# Altium schematic sheet rocket.SchDoc: Наименование
size 420 x 297 mm; ApprovedBy: Утвердил; CheckedBy: Проверил; Author: Разработал; CompanyName: ВлГУ; DrawnBy: Н.Контр; Engineer: Т.Контр; SheetNumber: 1; SheetTotal: 4; PageSetup: Record=PageOptions|CenterHorizontal=True|CenterVertical=True|PrintScale=0.94|XCorrection=1.00|YCorrection=1.00|PrintKind=1|BorderSize=5000000|LeftOffset=0|BottomOffset=0|Orientation=1|PaperLength=1000|PaperWidth=1000|Scale=100|PaperSource=7|PrintQuality=-4|MediaType=1|DitherType=10|PaperKind=A4|PrintScaleMode=1; HeadOfSector: Нач. сектора; MainDevice: Перв.примен.; Name: Наименование; DocumentName: Sheet1.SCHDOC
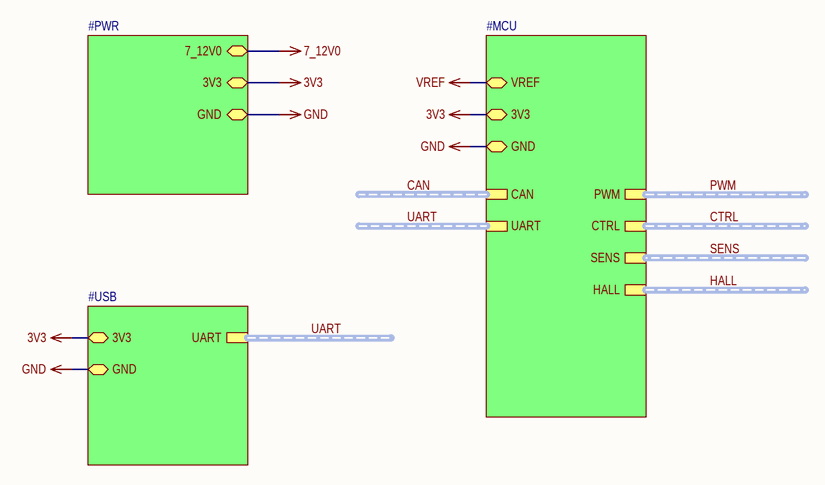
[diagram p0: rocket.SchDoc]

## Sub-sheets
#MCU = mcu.SchDoc: GND (bidir), 3V3 (bidir), CAN (harness CAN), UART (harness UART), CTRL (harness CTRL), VREF (bidir), SENS (harness SENS), HALL (harness HALL), PWM (harness PWM)
#PWR = power.SchDoc: 3V3 (bidir), GND (bidir), 7_12V0 (bidir)
#USB = usb.SchDoc: 3V3 (bidir), GND (bidir), UART (harness UART)

## Nets
3V3: sheet #PWR/3V3, sheet #USB/3V3, sheet #MCU/3V3
7_12V0: sheet #PWR/7_12V0
GND: sheet #PWR/GND, sheet #USB/GND, sheet #MCU/GND
VREF: sheet #MCU/VREF

## Buses and harness runs
harness CAN = sheet #MCU/CAN
harness CTRL = sheet #MCU/CTRL
harness HALL = sheet #MCU/HALL
harness PWM = sheet #MCU/PWM
harness SENS = sheet #MCU/SENS
harness UART = sheet #MCU/UART
harness UART = sheet #USB/UART

## Notes on the sheet
- Подп. и дата
- Инв.№ дубл.
- Взам.инв.№
- Подп.и дата
- Инв.№ подл.
- Изм.
- Лист
- № докум.
- Подп.
- Дата
- Формат  A3